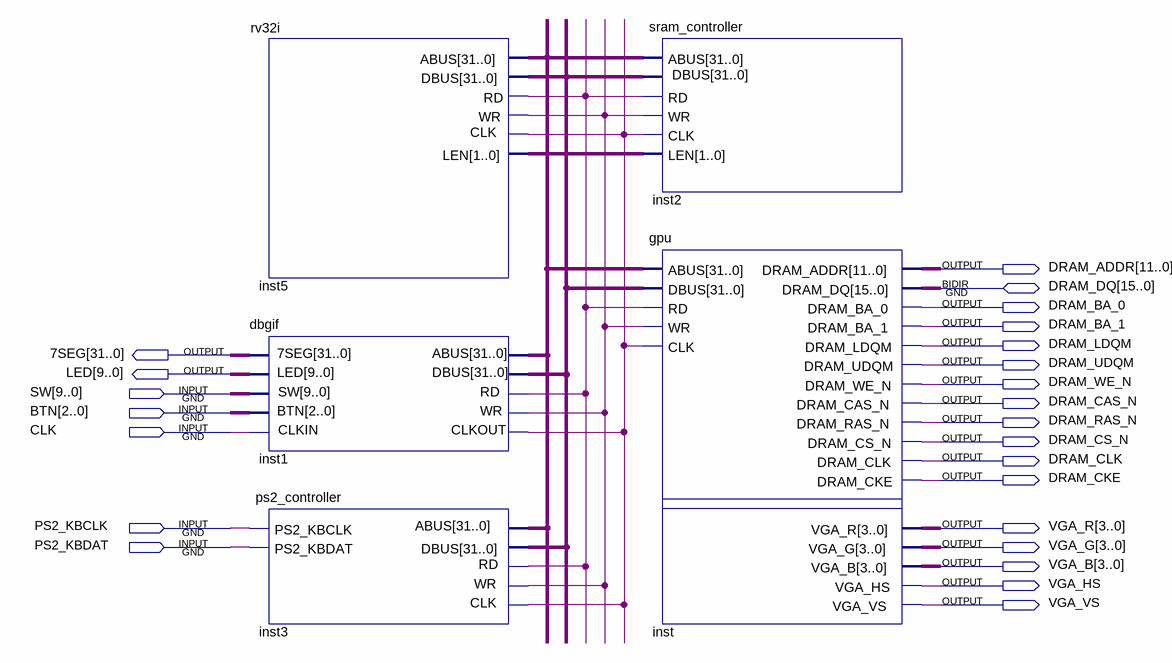
[diagram p0: schematic sheet]
// Quartus schematic ARP.bdf as structural Verilog: 5 symbols, 24 pins
module ARP (
  input  [9:0] SW,
  input  [2:0] BTN,
  input  CLK,
  input  PS2_KBCLK,
  input  PS2_KBDAT,
  inout  [15:0] DRAM_DQ,
  output [11:0] DRAM_ADDR,
  output DRAM_BA_0,
  output DRAM_BA_1,
  output DRAM_LDQM,
  output [31:0] \7SEG ,
  output DRAM_UDQM,
  output [9:0] LED,
  output DRAM_WE_N,
  output DRAM_CAS_N,
  output DRAM_RAS_N,
  output DRAM_CS_N,
  output DRAM_CLK,
  output DRAM_CKE,
  output [3:0] VGA_R,
  output [3:0] VGA_G,
  output [3:0] VGA_B,
  output VGA_HS,
  output VGA_VS
);

  wire inst1_clkout, inst5_rd, inst5_wr;
  wire [1:0] inst5_len;
  wire [31:0] inst5_abus, inst5_dbus;

  rv32i inst5 (.CLK(inst1_clkout), .ABUS(inst5_abus), .RD(inst5_rd), .WR(inst5_wr), .LEN(inst5_len), .DBUS(inst5_dbus));
  dbgif inst1 (
    .CLKIN(CLK), .BTN(BTN), .SW(SW), .ABUS(inst5_abus), .DBUS(inst5_dbus), .RD(inst5_rd), .WR(inst5_wr),
    .CLKOUT(inst1_clkout), .\7SEG (\7SEG ), .LED(LED));
  ps2_controller inst3 (
    .PS2_KBCLK(PS2_KBCLK), .PS2_KBDAT(PS2_KBDAT), .ABUS(inst5_abus), .RD(inst5_rd), .WR(inst5_wr),
    .CLK(inst1_clkout), .DBUS(inst5_dbus));
  sram_controller inst2 (
    .ABUS(inst5_abus), .CLK(inst1_clkout), .WR(inst5_wr), .RD(inst5_rd), .LEN(inst5_len), .DBUS(inst5_dbus));
  gpu inst (
    .ABUS(inst5_abus), .DBUS(inst5_dbus), .RD(inst5_rd), .WR(inst5_wr), .CLK(inst1_clkout),
    .DRAM_BA_0(DRAM_BA_0), .DRAM_BA_1(DRAM_BA_1), .DRAM_LDQM(DRAM_LDQM), .DRAM_UDQM(DRAM_UDQM),
    .DRAM_WE_N(DRAM_WE_N), .DRAM_CAS_N(DRAM_CAS_N), .DRAM_RAS_N(DRAM_RAS_N), .DRAM_CS_N(DRAM_CS_N),
    .DRAM_CLK(DRAM_CLK), .DRAM_CKE(DRAM_CKE), .VGA_R(VGA_R), .VGA_G(VGA_G), .VGA_B(VGA_B), .VGA_HS(VGA_HS),
    .VGA_VS(VGA_VS), .DRAM_ADDR(DRAM_ADDR), .DRAM_DQ(DRAM_DQ));
endmodule
